# Altium schematic sheet 原子战舰STM32F103ZET6.SchDoc
size A2
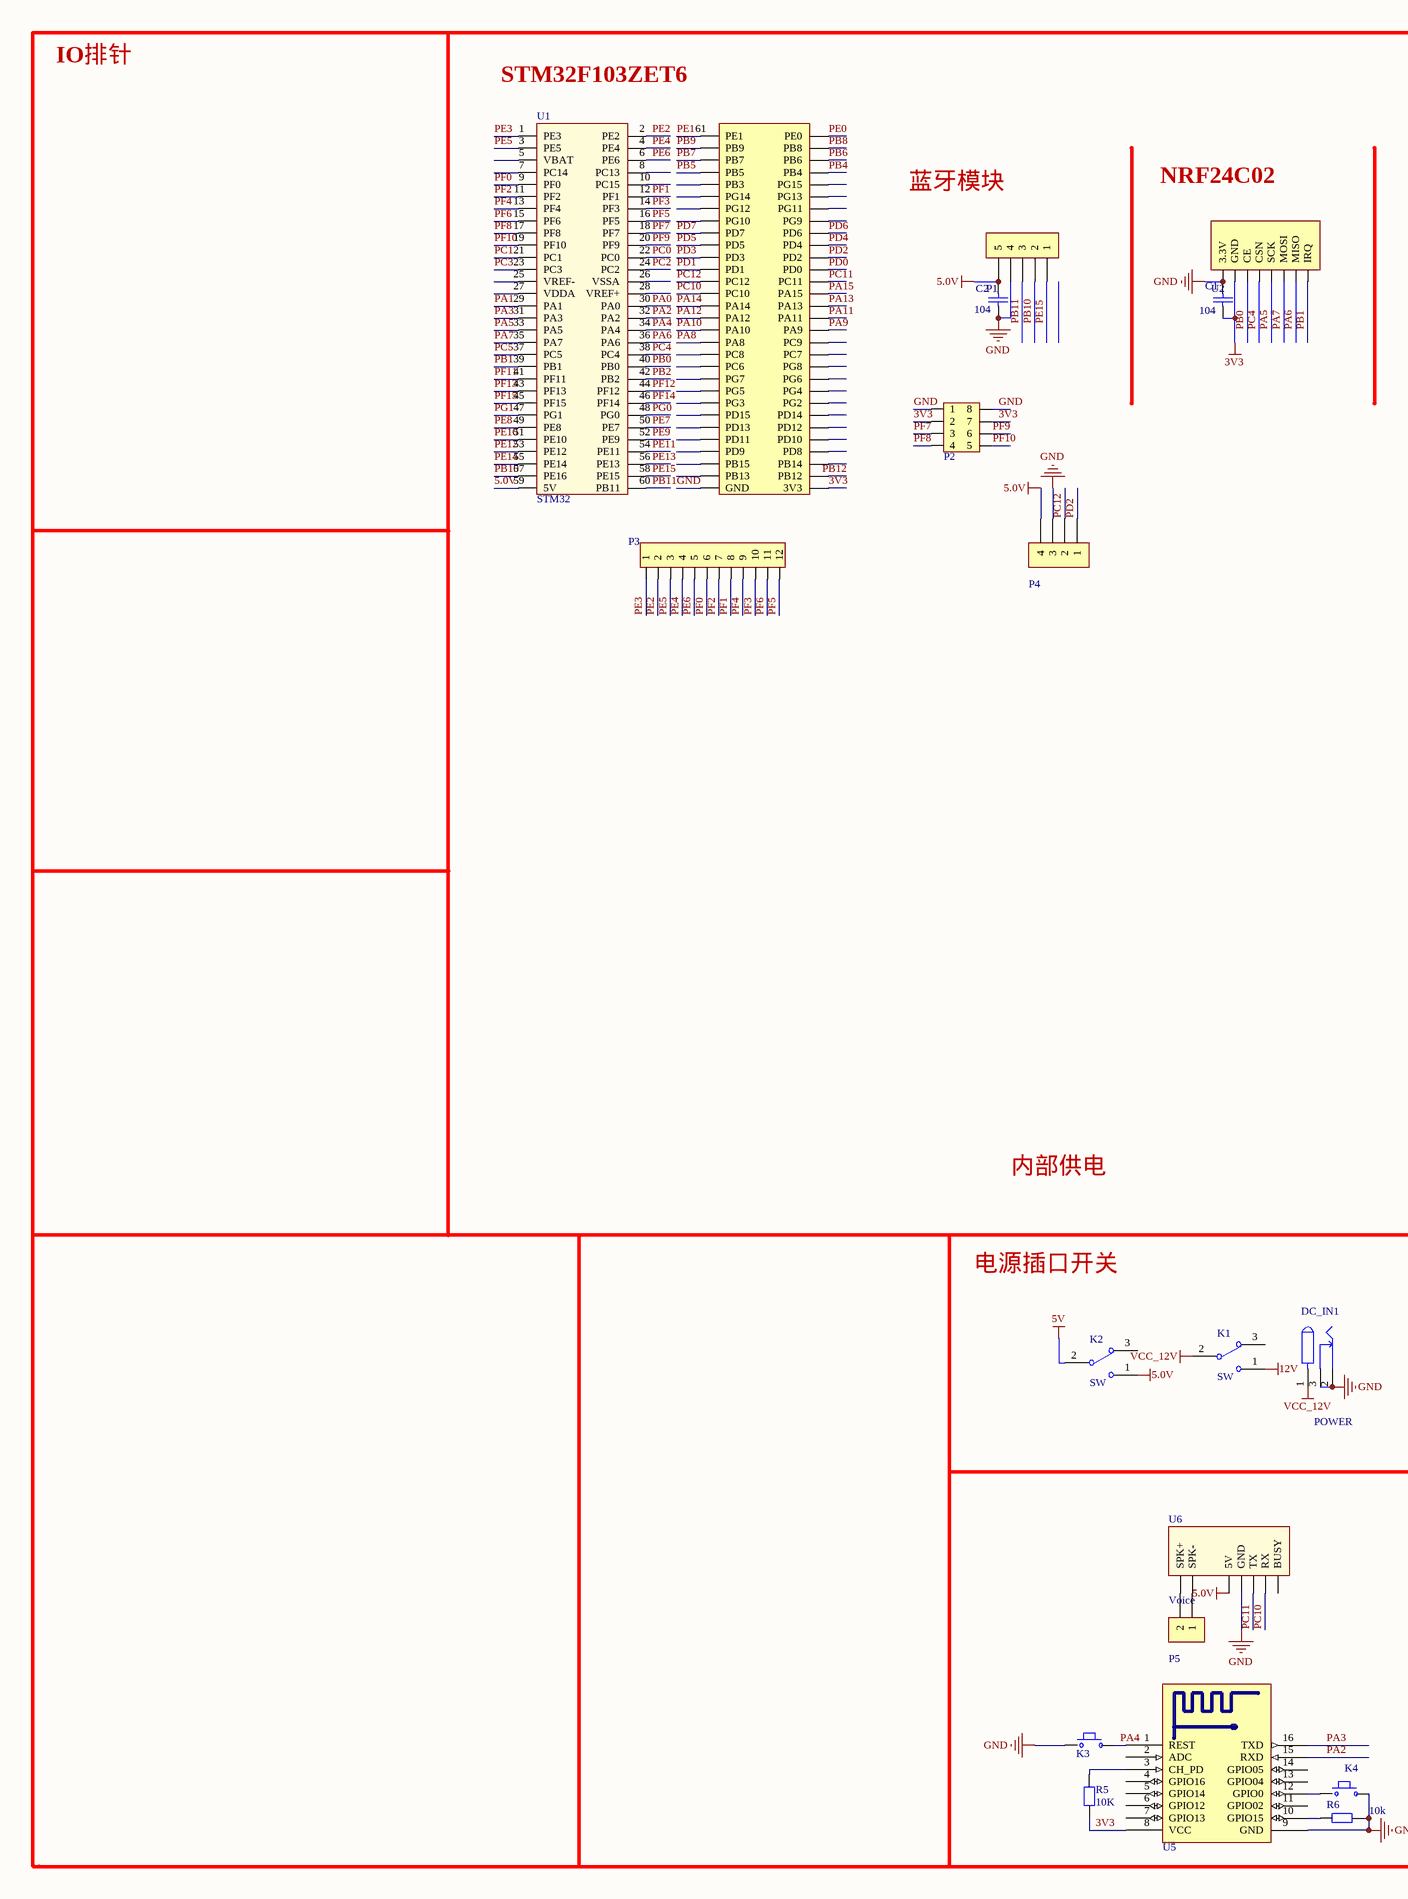
[diagram p0: 原子战舰STM32F103ZET6.SchDoc, left]
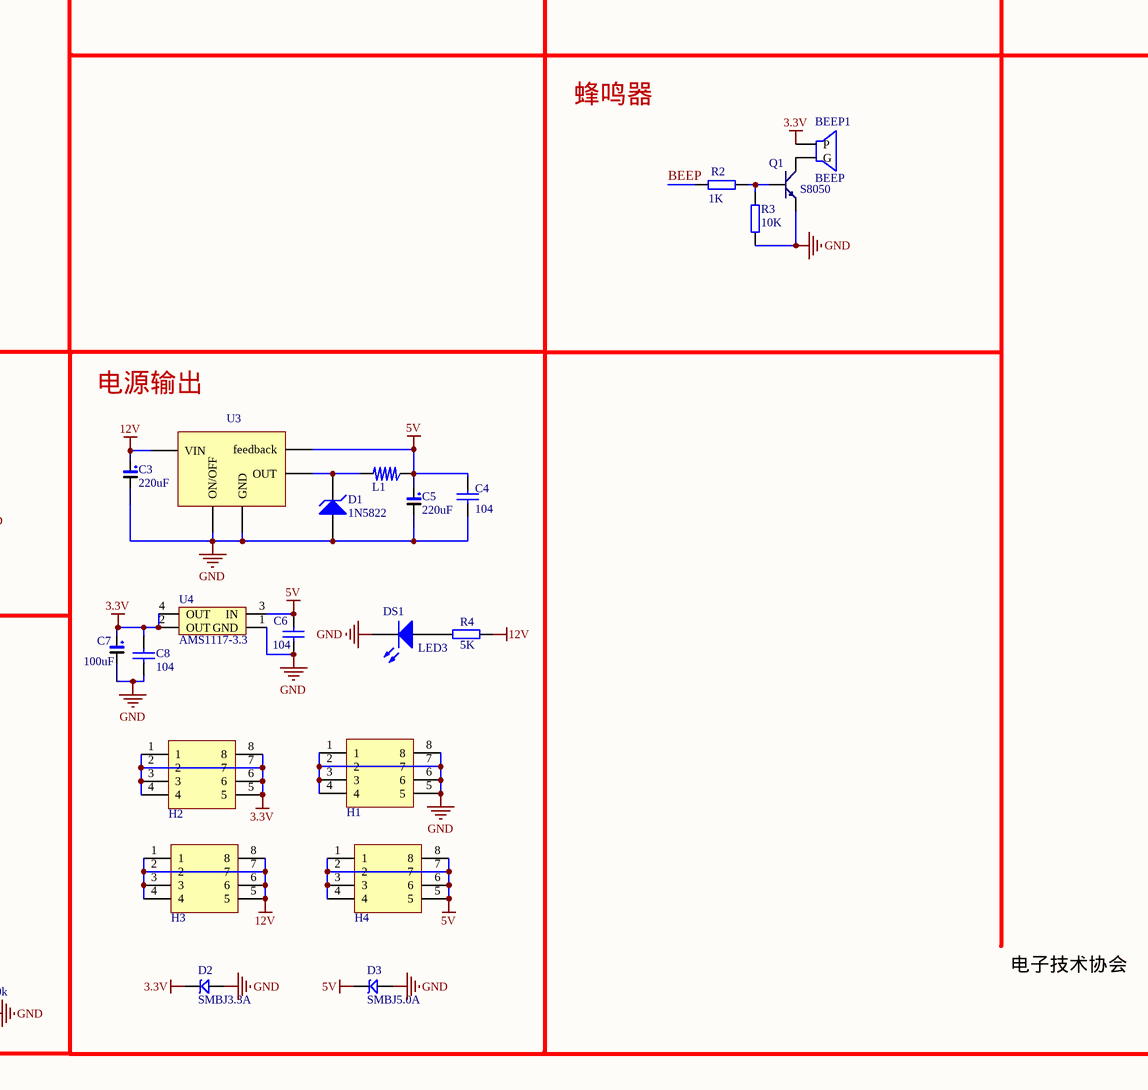
[diagram p1: 原子战舰STM32F103ZET6.SchDoc, right]

## Parts
BEEP1  BEEP  [BELL-5]
C1  104  [C0805]
C2  104  [C0805]
C3  220uF  [CAP-470-16V]
C4  104  [C0805]
C5  220uF  [CAP-470-16V]
C6  104  [C0805]
C7  100uF  [CAP-470-16V]
C8  104  [C0805]
D1  1N5822  [D-9.9X6.0MM]
D2  SMBJ3.3A  [SMBJ]
D3  SMBJ5.0A  [SMBJ]
DC_IN1  POWER  [DC10B]
DS1  LED3  [SMDLED]
H1  Header2-4  [Header2-4]  (value not drawn)
H2  Header2-4  [Header2-4]  (value not drawn)
H3  Header2-4  [Header2-4]  (value not drawn)
H4  Header2-4  [Header2-4]  (value not drawn)
K1  SW  [SW-07]
K2  SW  [SW-07]
K3  SW-TP  [SW-TP]  (value not drawn)
K4  SW-TP  [SW-TP]  (value not drawn)
L1  4.7uH  [L_SOP74]  (value not drawn)
P1  Header5  [Header5]  (value not drawn)
P2  Header4X2  [Header4X2]  (value not drawn)
P3  Header12  [Header12]  (value not drawn)
P4  Header4  [Header4]  (value not drawn)
P5  Header2  [Header2]  (value not drawn)
Q1  S8050  [SOT-23R]
R2  1K  [R0805]
R3  10K  [R0805]
R4  5K  [R0805]
R5  10K  [RES0805]
R6  10k  [RES0805]
U1  STM32  [STM32]
U2  Mini_24L01  [MINI_24L01]  (value not drawn)
U3  LM2596  [LM2596]  (value not drawn)
U4  AMS1117-3.3  [AMS1117]
U5  ESP-12  [ESP12]  (value not drawn)
U6  Voice  [Voice]

## Nets
3.3V: BEEP1.1(P) C7.1 C8.2 D2.2 H2.1 H2.2 H2.3 H2.4 H2.5 H2.6 H2.7 H2.8 U4.2(OUT) U4.4(OUT)
3V3: C1.1 P2.2 P2.7 R5.1 U1.91(3V3) U2.2(GND) U5.8(VCC)
5.0V: C2.2 K2.1 P1.5 P4.4 U1.59(5V) U6.2(5V)
5V: C4.2 C5.1 C6.2 D3.2 H4.1 H4.2 H4.3 H4.4 H4.5 H4.6 H4.7 H4.8 K2.2 L1.1 U3.4(feedback) U4.3(IN)
12V: C3.1 H3.1 H3.2 H3.3 H3.4 H3.5 H3.6 H3.7 H3.8 K1.1 R4.2 U3.1(VIN)
GND: C1.2 C2.1 C3.2 C4.1 C5.2 C6.1 C7.2 C8.1 D1.1(A) D2.1 D3.1 DC_IN1.2 DC_IN1.3 DS1.2(K) H1.1 H1.2 H1.3 H1.4 H1.5 H1.6 H1.7 H1.8 K3.1 K4.2 P1.4 P2.1 P2.8 P4.3 Q1.1(E) R3.1 R6.2 U1.90(GND) U2.1(3.3V) U3.3(GND) U3.5(ON/OFF) U4.1(GND) U5.9(GND) U6.3(GND)
VCC_12V: DC_IN1.1 K1.2
BEEP: R2.1
PA0: U1.30(PA0)
PA1: U1.29(PA1)
PA2: U1.32(PA2) U5.15(RXD)
PA3: U1.31(PA3) U5.16(TXD)
PA4: K3.2 U1.34(PA4) U5.1(REST)
PA5: U1.33(PA5) U2.5(SCK)
PA6: U1.36(PA6) U2.7(MISO)
PA7: U1.35(PA7) U2.6(MOSI)
PA8: U1.78(PA8)
PA9: U1.104(PA9)
PA10: U1.77(PA10)
PA11: U1.105(PA11)
PA12: U1.76(PA12)
PA13: U1.106(PA13)
PA14: U1.75(PA14)
PA15: U1.107(PA15)
PB0: U1.40(PB0) U2.3(CE)
PB1: U1.39(PB1) U2.8(IRQ)
PB2: U1.42(PB2)
PB4: U1.117(PB4)
PB5: U1.64(PB5)
PB6: U1.118(PB6)
PB7: U1.63(PB7)
PB8: U1.119(PB8)
PB9: U1.62(PB9)
PB10: P1.2 U1.57(PE16)
PB11: P1.3 U1.60(PB11)
PC0: U1.22(PC0)
PC1: U1.21(PC1)
PC2: U1.24(PC2)
PC3: U1.23(PC3)
PC4: U1.38(PC4) U2.4(CSN)
PC5: U1.37(PC5)
PC10: U1.74(PC10) U6.5(RX)
PC11: U1.108(PC11) U6.4(TX)
PC12: P4.2 U1.73(PC12)
PD0: U1.109(PD0)
PD1: U1.72(PD1)
PD2: P4.1 U1.110(PD2)
PD3: U1.71(PD3)
PD4: U1.111(PD4)
PD5: U1.70(PD5)
PD6: U1.112(PD6)
PD7: U1.69(PD7)
PE0: U1.120(PE0)
PE1: U1.61(PE1)
PE2: P3.2 U1.2(PE2)
PE3: P3.1 U1.1(PE3)
PE4: P3.4 U1.4(PE4)
PE5: P3.3 U1.3(PE5)
PE6: P3.5 U1.6(PE6)
PE7: U1.50(PE7)
PE8: U1.49(PE8)
PE9: U1.52(PE9)
PE10: U1.51(PE10)
PE11: U1.54(PE11)
PE12: U1.53(PE12)
PE13: U1.56(PE13)
PE14: U1.55(PE14)
PE15: P1.1 U1.58(PE15)
PF0: P3.6 U1.9(PF0)
PF1: P3.8 U1.12(PF1)
PF2: P3.7 U1.11(PF2)
PF3: P3.10 U1.14(PF3)
PF4: P3.9 U1.13(PF4)
PF5: P3.12 U1.16(PF5)
PF6: P3.11 U1.15(PF6)
PF7: P2.3 U1.18(PF7)
PF8: P2.4 U1.17(PF8)
PF9: P2.6 U1.20(PF9)
PF10: P2.5 U1.19(PF10)
PF11: U1.41(PF11)
PF12: U1.44(PF12)
PF13: U1.43(PF13)
PF14: U1.46(PF14)
PF15: U1.45(PF15)
PG0: U1.48(PG0)
PG1: U1.47(PG1)
NetBEEP1_2: BEEP1.2(G) Q1.3(C)
NetD1_2: D1.2(K) L1.2 U3.2(OUT)
NetDS1_1: DS1.1(A) R4.1
NetK4_1: K4.1 U5.12(GPIO0)
NetP5_1: P5.1 U6.1(SPK-)
NetP5_2: P5.2 U6.0(SPK+)
NetQ1_2: Q1.2(B) R2.2 R3.2
NetR5_2: R5.2 U5.3(CH_PD)
NetR6_1: R6.1 U5.10(GPIO15)

Not connected (* = marked no-connect by the designer): K1 3; K2 3; U1 5(VBAT) 7(PC14) 8(PC13) 10(PC15) 25(VREF-) 26(VSSA) 27(VDDA) 28(VREF+) 65(PB3) 66(PG14) 67(PG12) 68(PG10) 79(PC8) 80(PC6) 81(PG7) 82(PG5) 83(PG3) 84(PD15) 85(PD13) 86(PD11) 87(PD9) 88(PB15) 89(PB13) 92(PB12) 93(PB14) 94(PD8) 95(PD10) 96(PD12) 97(PD14) 98(PG2) 99(PG4) 100(PG6) 101(PG8) 102(PC7) 103(PC9) 113(PG9) 114(PG11) 115(PG13) 116(PG15); U5 2(ADC) 4(GPIO16) 5(GPIO14) 6(GPIO12) 7(GPIO13) 11(GPIO02) 13(GPIO04) 14(GPIO05); U6 6(BUSY)

## Notes on the sheet
- IO排针
- (near U1) STM32F103ZET6
- 蓝牙模块
- NRF24C02
- 蜂鸣器
- 内部供电
- 电源插口开关
- 电源输出
- Labels drawn without touching a wire or pin: PB12, 电子技术协会

## Library data of the parts
C1 C2 C4 C6 C8 = CAP0805
C3 C5 C7 = CAP-470-16V
D1 = D Zener: Zener Diode
D2 D3 = SMBJ: TVS
DC_IN1 = POW
DS1 = LED2: Typical RED, GREEN, YELLOW, AMBER GaAs LED; Published: 8-Jun-2000; LatestRevisionDate: 17-Jul-2002; LatestRevisionNote: Re-released for DXP Platform.; PackageDocument: Feb-2002; PackageReference: 3.2X1.6X1.1; Publisher: Altium Limited
K1 K2 = SW-07
L1 = L_SOP
Q1 = NPN: 8050/BCW846/BCW847
R2-R4 = Res-0805
R5 R6 = RES0805
U4 = AMS1117